# EAGLE design 304_usb (EAGLE 7.6.0)
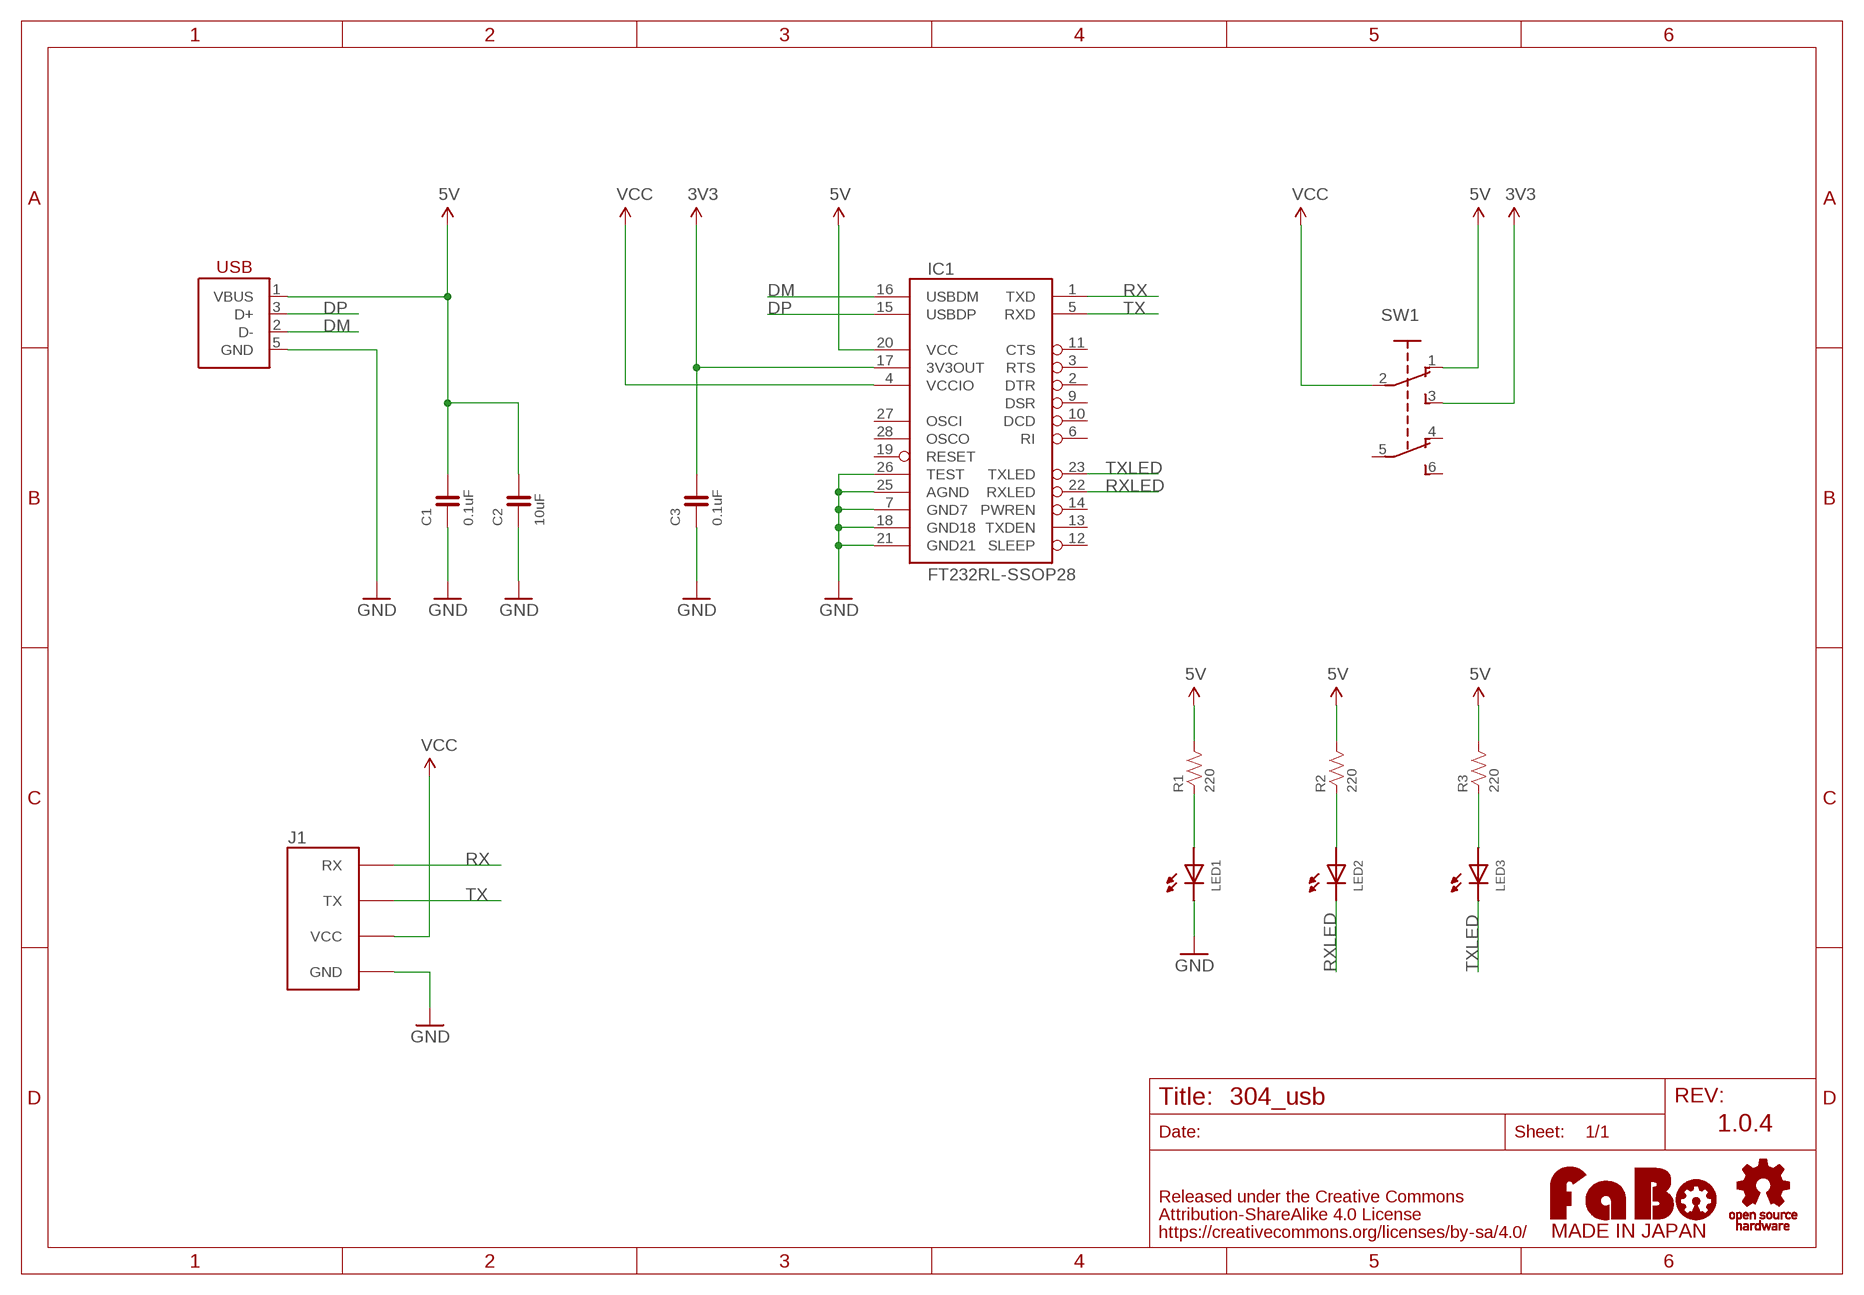
[diagram p0: schematic, sheet 1]

## Parts
C1  0.1uF  CAPACITOR-0603  [0603]
C2  10uF  CAPACITOR-0603  [0603]
C3  0.1uF  CAPACITOR-0603  [0603]
IC1  FT232RL-SSOP28  [SSOP28]
J1  FABO_BRICK_SERIAL  [FABO_BRICK_SERIAL]
JP1  USB-MICRO_B_SMT  [DX4R005JJ2R1800]
LED1  LED-0603  [0603]
LED2  LED-0603  [0603]
LED3  LED-0603  [0603]
R1  220  RESISTOR-0603  [0603]
R2  220  RESISTOR-0603  [0603]
R3  220  RESISTOR-0603  [0603]
SW1  SWITCH-SLIDE_2C2P-JS202011SCQN  [C&K_JS202011SCQN]
U$5  LOGO_OSHW-M_BOTTOM  [LOGO_OSHW_M_BOTTOM]
U$6  LOGO_FABO-M_BOTTOM  [LOGO_FABO_MS_BOTTOM]

## Nets
3V3: C3.2 IC1.17(3V3OUT) SW1.3
5V: C1.2 C2.2 IC1.20(VCC) JP1.1(VBUS) R1.2 R2.2 R3.2 SW1.1
DM: IC1.16(USBDM) JP1.2(D-)
DP: IC1.15(USBDP) JP1.3(D+)
GND: C1.1 C2.1 C3.1 IC1.7(GND7) IC1.18(GND18) IC1.21(GND21) IC1.25(AGND) IC1.26(TEST) J1.GND JP1.5(GND) LED1.CATHODE
N$1: LED1.ANODE R1.1
N$2: LED3.ANODE R3.1
N$3: LED2.ANODE R2.1
RX: IC1.1(TXD) J1.RX
RXLED: IC1.22(RXLED) LED2.CATHODE
TX: IC1.5(RXD) J1.TX
TXLED: IC1.23(TXLED) LED3.CATHODE
VCC: IC1.4(VCCIO) J1.VCC SW1.2
Unconnected: IC1.2(DTR) IC1.3(RTS) IC1.6(RI) IC1.9(DSR) IC1.10(DCD) IC1.11(CTS) IC1.12(SLEEP) IC1.13(TXDEN) IC1.14(PWREN) IC1.19(RESET) IC1.27(OSCI) IC1.28(OSCO) SW1.4 SW1.5 SW1.6

## Notes on the sheet
- 1.0.4

## Library data of the parts
C1-C3 = FaBo-Capacitor:CAPACITOR: CAPACITOR
IC1 = FaBo-etc:FT232RL: FT232RL FTDI FT232RL USB to serial UART interface SSOP28
J1 = FaBo-Template:FABO_BRICK_SERIAL: FaBo Brick Serial
JP1 = FaBo-etc:USB
LED1-LED3 = FaBo-LED:LED
R1-R3 = FaBo-Resistors:RESISTOR: RESISTOR
SW1 = FaBo-etc:SWITCH-SLIDE_2C2P
U$5 = FaBo-etc:LOGO_OSHW
U$6 = FaBo-etc:LOGO_FABO

## Board
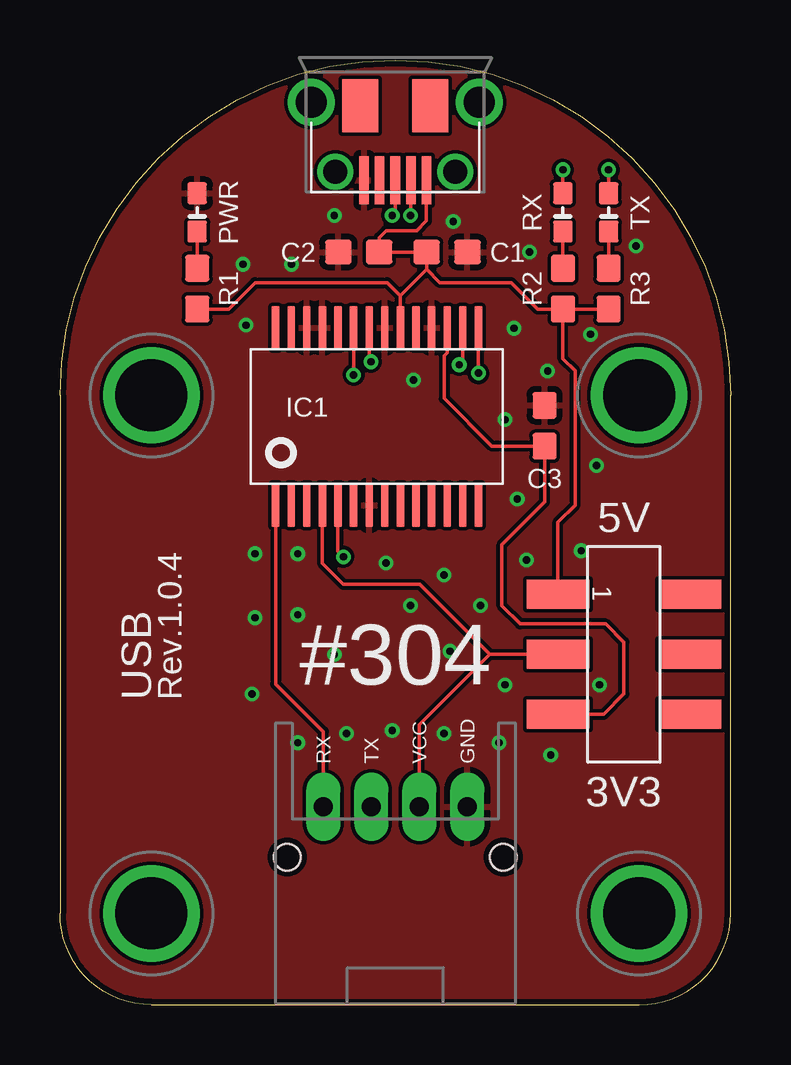
[diagram p1: board, top side]
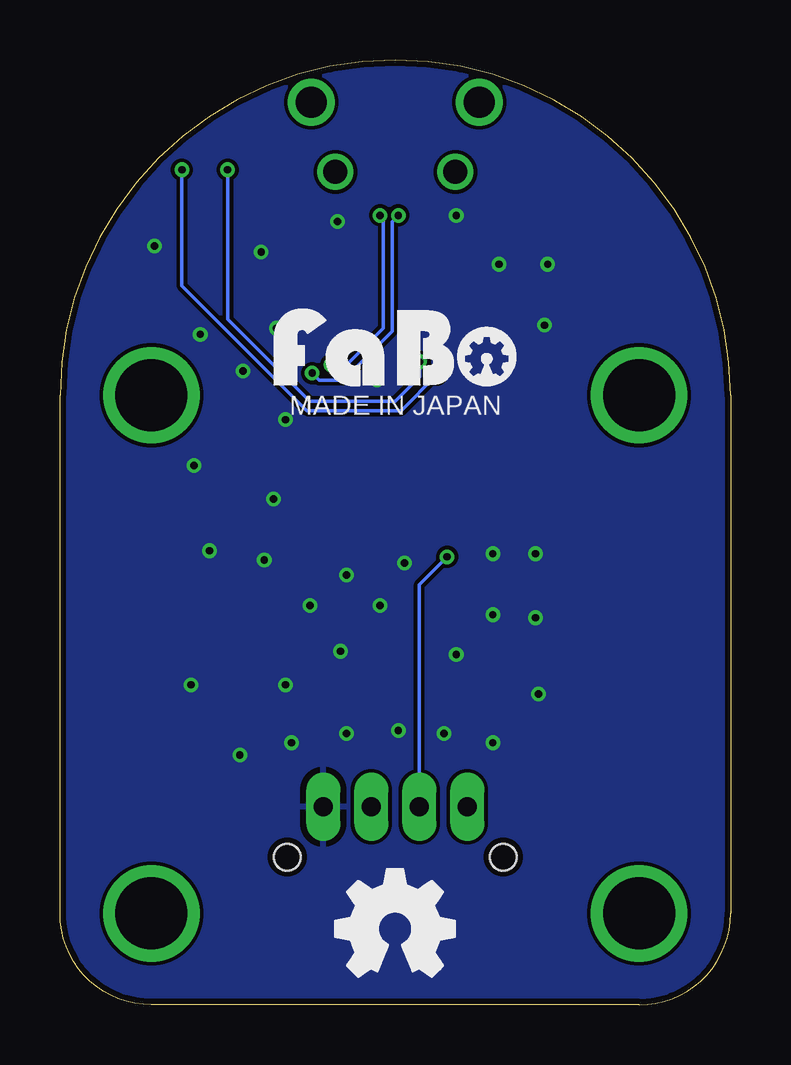
[diagram p2: board, bottom side, seen from below]

Size 27.94 x 39.37 mm. Coordinates in mm from the lower left corner, seen from the top.
Copper layers (1*16): Top 0.035mm / dielectric 1.5mm / Bottom 0.035mm
Design rules "SeeedStudio_2layer_DRU_no_angle_20140221": minimum track width 6mil, minimum drill 12mil, track to track 6mil, track to pad 6mil, pad to pad 6mil, via to via 6mil, smd to smd 0mil, copper to edge 10mil, drill to drill 10mil, minimum pad ring 10mil, minimum via ring 6mil, stop-mask expansion 2mil, vias tented up to drill 100mil, thermal gap 10mil

### Footprints (pad centres in the part's own frame; a part is rotated, then mirrored left to right if it is on the bottom)
0603 = smd 1.1 x 1: 1 -0.85,0; 2 0.85,0
SSOP28 = smd 0.32 x 1.8: 1 -4.225,-3.7; 2 -3.575,-3.7; 3 -2.925,-3.7; 4 -2.275,-3.7; 5 -1.625,-3.7; 6 -0.975,-3.7; 7 -0.325,-3.7; 8 0.325,-3.7; 9 0.975,-3.7; 10 1.625,-3.7; 11 2.275,-3.7; 12 2.925,-3.7; 13 3.575,-3.7; 14 4.225,-3.7; 15 4.225,3.7; 16 3.575,3.7; 17 2.925,3.7; 18 2.275,3.7; 19 1.625,3.7; 20 0.975,3.7; 21 0.325,3.7; 22 -0.325,3.7; 23 -0.975,3.7; 24 -1.625,3.7; 25 -2.275,3.7; 26 -2.925,3.7; 27 -3.575,3.7; 28 -4.225,3.7
FABO_BRICK_SERIAL = drill 0.8 pad 1.422 long: GND 3,-10.795; RX -3,-10.795; TX -1,-10.795; VCC 1,-10.795 | drill 3 pad 3.81: P$1 -10.16,6.35; P$2 10.16,6.35; P$3 -10.16,-15.24; P$4 10.16,-15.24 | hole 1.1: -4.5,-12.895; 4.5,-12.895
DX4R005JJ2R1800 = smd 0.4 x 2: 1 -1.3,4.5; 2 -0.65,4.5; 3 0,4.5; 4 0.65,4.5; 5 1.3,4.5 | smd 1.5 x 2.2: 6 -1.45,1.4; 7 1.45,1.4 | drill 1 pad 1.4: P$1 -2.5,4.15; P$2 2.5,4.15 | drill 1.3 pad 1.7: P$3 -3.5,1.25; P$4 3.5,1.25
0603' = smd 0.9 x 0.8: ANODE -0.8,0; CATHODE 0.8,0
C&K_JS202011SCQN = smd 2.6 x 1.2: 1 -2.75,2.5; 2 -2.75,0; 3 -2.75,-2.5; 4 2.75,2.5; 5 2.75,0; 6 2.75,-2.5

### Placement (x,y rotation side)
C1  16.13,31.37 180 top
C2  12.45,31.37 0 top
C3  20.19,24.13 270 top
IC1  13.21,24.51 0 top
J1  13.97,19.05 0 top
JP1  13.97,38.86 180 top
LED1  [0603']  5.71,33.02 90 top
LED2  [0603']  20.95,33.02 90 top
LED3  [0603']  22.86,33.02 90 top
R1  5.71,29.84 270 top
R2  20.95,29.84 270 top
R3  22.86,29.84 270 top
SW1  23.5,14.61 0 top
U$5  13.97,3.17 0 top
U$6  13.97,25.4 0 top

### Tracks (layer width: path | path; a pad name or v marks a point on that pad's centre or on a via)
3V3
  Top 0.152: IC1.17 16.13,27.18 16,27.05 16,25.27 18,23.28 C3.2 20.19,20.95 18.41,19.18 18.41,16.64 19.18,15.88 22.73,15.88 23.5,15.11 23.5,12.95 22.65,12.11 SW1.3
5V
  Top 0.152: JP1.1 15.27,32.67 14.86,32.26 13.59,32.26 13.3,31.96 C2.2 C1.2 | 15.2,31.42 C1.2 | 14.18,29.55 15.28,30.65 | C1.2 15.28,30.65 | R2.2 19.9,29 18.8,30.1 15.83,30.1 15.28,30.65 | IC1.20 14.18,29.55 | R2.2 R3.2 | SW1.1 20.75,20.11 21.46,20.83 21.46,26.42 20.95,26.92 R2.2 | R1.2 7.02,29 8.13,30.1 13.63,30.1 14.18,29.55
DM  (via drill 0.3)
  Top 0.152: JP1.2 14.62,32.91 v14.61,32.89 | IC1.16 16.78,26.82 v16.64,26.67
  Bottom 0.152: v14.61,32.89 14.48,32.77 14.48,28.19 16,26.67 v16.64,26.67
DP  (via drill 0.3)
  Top 0.152: JP1.3 13.97,33.02 v13.84,32.89 | IC1.15 v17.43,26.32
  Bottom 0.152: v13.84,32.89 14.1,32.64 14.1,28.07 16.13,26.04 17.14,26.04 v17.43,26.32
GND  (via drill 0.3)
  other vias: 8.13,18.8 9.91,18.8 8.13,16.13 8,12.95 9.91,10.92 11.94,11.3 13.84,11.43 16,11.3 18.54,13.34 16.26,14.73 13.59,18.41 17.53,16.64 19.05,21.08 19.43,18.54 21.72,18.92 22.48,13.34 18.29,10.92 22.35,22.48 20.32,26.42 18.92,28.19 18.54,24.38 7.75,28.32 7.62,30.86 9.65,30.86 19.56,31.37 22.1,27.94 24,31.62 16.38,32.64 11.43,32.89 14.73,26.04 9.91,16.26 14.61,16.64 16,17.91 11.43,14.61 20.45,10.41
  pour Bottom: 0,0 27.94,0 27.94,39.37 0,39.37
  pour Top: 0,0 27.94,0 27.94,39.37 0,39.37
N$1
  Top 0.152: LED1.ANODE R1.1
N$2
  Top 0.152: LED3.ANODE R3.1
N$3
  Top 0.152: LED2.ANODE R2.1
RX
  Top 0.152: J1.RX 10.97,11.38 8.98,13.37 IC1.1
RXLED  (via drill 0.3)
  Top 0.152: IC1.22 12.88,26.87 v12.95,26.8 | LED2.CATHODE v20.95,34.8
  Bottom 0.152: v12.95,26.8 12.95,26.16 13.97,25.15 17.53,25.15 20.95,28.57 v20.95,34.8
TX  (via drill 0.3)
  Top 0.152: IC1.5 11.58,18.9 v11.81,18.67
  Bottom 0.152: J1.TX 12.97,17.51 v11.81,18.67
TXLED  (via drill 0.3)
  Top 0.152: IC1.23 v12.23,26.25 | LED3.CATHODE v22.86,34.8
  Bottom 0.152: v22.86,34.8 22.86,29.97 17.65,24.77 13.72,24.77 v12.23,26.25
VCC
  Top 0.152: J1.VCC 14.97,11.67 17.91,14.61 | 17.91,14.61 SW1.2 | IC1.4 10.93,18.4 11.81,17.53 14.99,17.53 17.91,14.61

### Text on the board
tPlace: PWR | RX | TX | 5V | USB | Rev.1.0.4 | #304 | 3V3
bPlace: MADE IN JAPAN